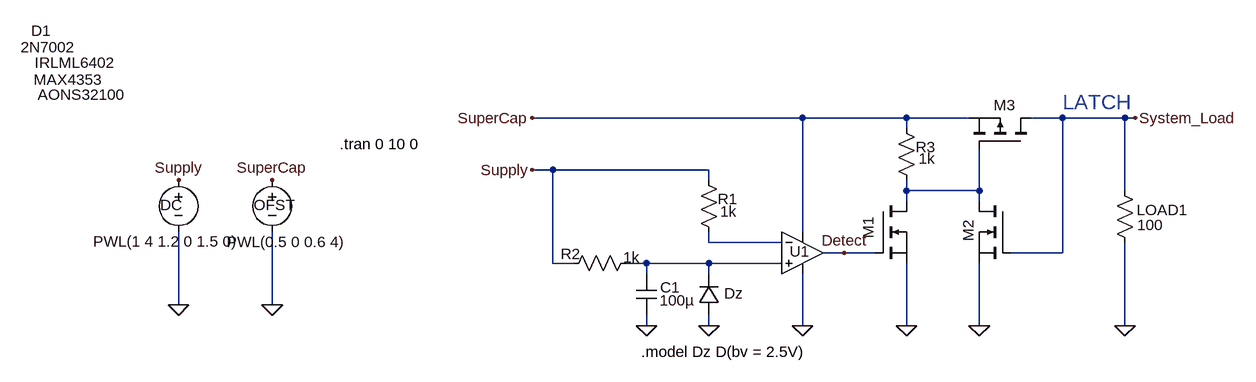
[diagram p0: schematic Under-Voltger Protection.asc]
Under-Voltger Protection.asc, the LTspice schematic file:
Version 4
SHEET 1 3684 680
WIRE 2640 -432 2224 -432
WIRE 2800 -432 2640 -432
WIRE 2896 -432 2800 -432
WIRE 3040 -432 2992 -432
WIRE 3136 -432 3040 -432
WIRE 3152 -432 3136 -432
WIRE 2800 -416 2800 -432
WIRE 2256 -352 2224 -352
WIRE 2496 -352 2256 -352
WIRE 2496 -336 2496 -352
WIRE 2800 -320 2800 -336
WIRE 2912 -320 2912 -384
WIRE 2912 -320 2800 -320
WIRE 3136 -320 3136 -432
WIRE 2800 -304 2800 -320
WIRE 2912 -304 2912 -320
WIRE 2640 -256 2640 -432
WIRE 2496 -240 2496 -256
WIRE 2608 -240 2496 -240
WIRE 2704 -224 2672 -224
WIRE 2752 -224 2704 -224
WIRE 3040 -224 3040 -432
WIRE 3040 -224 2960 -224
WIRE 2256 -208 2256 -352
WIRE 2288 -208 2256 -208
WIRE 2400 -208 2368 -208
WIRE 2496 -208 2400 -208
WIRE 2608 -208 2496 -208
WIRE 2400 -192 2400 -208
WIRE 2496 -192 2496 -208
WIRE 1680 -144 1680 -256
WIRE 1824 -144 1824 -256
WIRE 2400 -112 2400 -128
WIRE 2496 -112 2496 -128
WIRE 2640 -112 2640 -192
WIRE 2800 -112 2800 -208
WIRE 2912 -112 2912 -208
WIRE 3136 -112 3136 -240
FLAG 1680 -144 0
FLAG 1680 -336 Supply
FLAG 1824 -144 0
FLAG 1824 -336 SuperCap
FLAG 2640 -112 0
FLAG 2496 -112 0
FLAG 2400 -112 0
FLAG 2224 -432 SuperCap
FLAG 3152 -432 System_Load
FLAG 2912 -112 0
FLAG 3136 -112 0
FLAG 2800 -112 0
FLAG 2224 -352 Supply
FLAG 2704 -224 Detect
SYMBOL voltage 1680 -352 R0
WINDOW 123 0 0 Left 0
WINDOW 39 0 0 Left 0
WINDOW 0 -28 54 Left 2
WINDOW 3 -131 110 Left 2
SYMATTR InstName DC
SYMATTR Value PWL(1 4 1.2 0 1.5 0)
SYMBOL voltage 1824 -352 R0
WINDOW 123 0 0 Left 0
WINDOW 39 0 0 Left 0
WINDOW 0 -28 54 Left 2
WINDOW 3 -70 111 Left 2
SYMATTR InstName OFST
SYMATTR Value PWL(0.5 0 0.6 4)
SYMBOL diode 2512 -128 R180
WINDOW 0 1028 438 Left 2
WINDOW 3 -37 34 Left 2
SYMATTR InstName D1
SYMATTR Value Dz
SYMBOL res 2384 -224 R90
WINDOW 0 17 101 VBottom 2
WINDOW 3 -9 7 VTop 2
SYMATTR InstName R2
SYMATTR Value 1k
SYMBOL res 2512 -240 R180
WINDOW 0 -28 67 Left 2
WINDOW 3 -27 48 Left 2
SYMATTR InstName R1
SYMATTR Value 1k
SYMBOL cap 2384 -192 R0
WINDOW 0 37 21 Left 2
WINDOW 3 36 41 Left 2
SYMATTR InstName C1
SYMATTR Value 100µ
SYMBOL OpAmps\\MAX4353 2640 -288 R0
WINDOW 0 -20 62 Left 2
WINDOW 3 -1183 -203 Left 2
SYMATTR InstName U1
SYMBOL nmos 2752 -304 R0
WINDOW 0 -11 58 VLeft 2
WINDOW 3 -1289 -164 Left 2
SYMATTR InstName M1
SYMATTR Value AONS32100
SYMBOL res 2816 -320 R180
WINDOW 0 -29 67 Left 2
WINDOW 3 -28 49 Left 2
SYMATTR InstName R3
SYMATTR Value 1k
SYMBOL nmos 2960 -304 M0
WINDOW 0 65 63 VLeft 2
WINDOW 3 1438 -237 Left 2
SYMATTR InstName M2
SYMATTR Value 2N7002
SYMBOL pmos 2992 -384 M270
WINDOW 0 68 58 VLeft 2
WINDOW 3 133 1533 VLeft 2
SYMATTR InstName M3
SYMATTR Value IRLML6402
SYMBOL res 3120 -336 R0
WINDOW 0 34 46 Left 2
WINDOW 3 35 69 Left 2
SYMATTR InstName LOAD1
SYMATTR Value 100
TEXT 1928 -392 Left 2 !.tran 0 10 0
TEXT 2392 -72 Left 2 !.model Dz D(bv = 2.5V)
TEXT 3040 -456 Left 3 ;LATCH

The netlist it stands for:
* Under-Voltger Protection.asc
V§DC Supply 0 PWL(1 4 1.2 0 1.5 0)
V§OFST SuperCap 0 PWL(0.5 0 0.6 4)
D1 0 N003 Dz
R2 N003 Supply 1k
R1 N002 Supply 1k
C1 N003 0 100µ
XU1 N003 N002 SuperCap 0 Detect MAX4353  ; pins In+ In- V+ V- OUT
M1 N001 Detect 0 0 AONS32100
R3 N001 SuperCap 1k
M2 N001 System_Load 0 0 2N7002
M3 System_Load N001 SuperCap SuperCap IRLML6402
R§LOAD1 System_Load 0 100
.model D D
.lib standard.dio
.model NMOS NMOS
.model PMOS PMOS
.lib standard.mos
.tran 0 10 0
.model Dz D(bv = 2.5V)
* LATCH
.backanno
.end